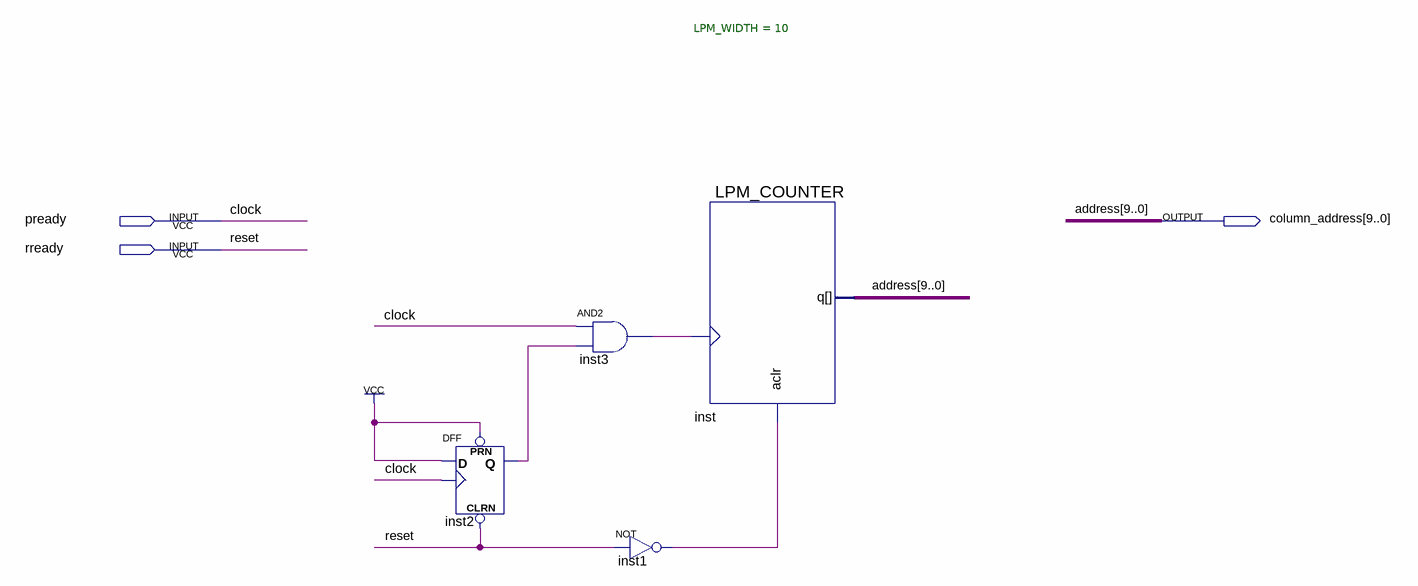
[diagram p0: schematic sheet]
// Quartus schematic column_counter.bdf as structural Verilog: 4 symbols, 3 pins
module column_counter (
  input  pready,
  input  rready,
  output [9:0] column_address
);

  wire inst1_out, inst2_q, inst3_out;

  DFF inst2 (.CLRN(rready), .CLK(pready), .D(1'b1), .PRN(1'b1), .Q(inst2_q));
  and inst3 (inst3_out, pready, inst2_q);
  not inst1 (inst1_out, rready);
  LPM_COUNTER #(.LPM_WIDTH(10)) inst (.aclr(inst1_out), .clock(inst3_out), .q(column_address));

  // Other names for the same wires on the sheet: address[9:0] = column_address; clock = pready; reset = rready
endmodule
